# EAGLE design Arduino_Uno (EAGLE 9.6.1)
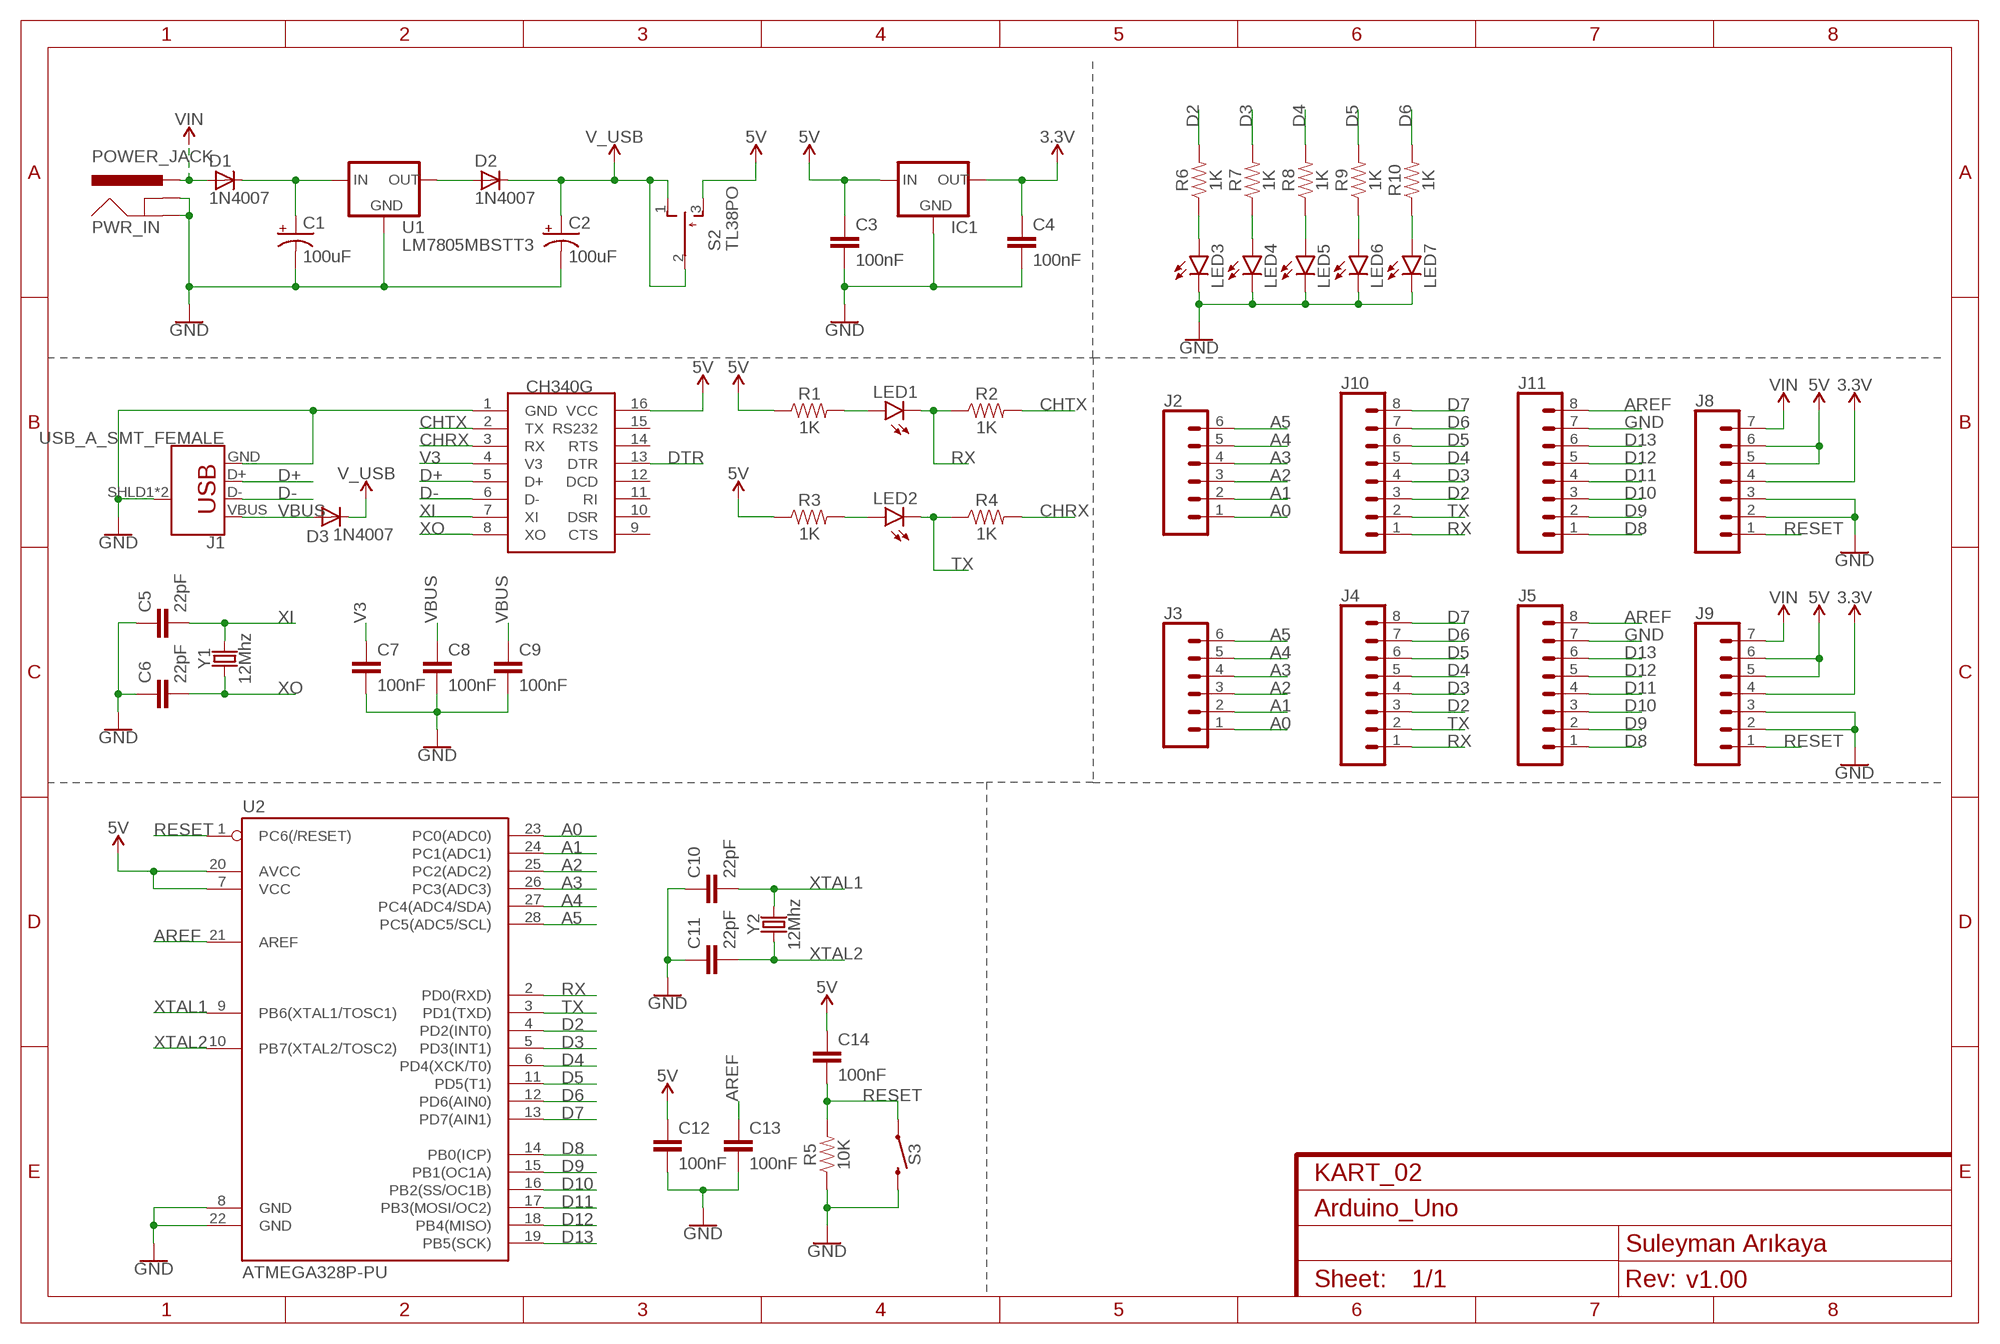
[diagram p0: schematic, sheet 1]
FRAME1 (FRAME-A4L): CNAME: KART_02; CREVISION: v1.00; DESIGNER: Suleyman Arıkaya

## Parts
C1  100uF  100UF-POLAR-25V-20%(ELEC)  [PANASONIC_D]
C2  100uF  100UF-POLAR-25V-20%(ELEC)  [PANASONIC_D]
C3  100nF  1.0UF-0805-25V-10%  [0805]
C4  100nF  1.0UF-0805-25V-10%  [0805]
C5  22pF  1.0UF-0805-25V-10%  [0805]
C6  22pF  1.0UF-0805-25V-10%  [0805]
C7  100nF  1.0UF-0805-25V-10%  [0805]
C8  100nF  1.0UF-0805-25V-10%  [0805]
C9  100nF  1.0UF-0805-25V-10%  [0805]
C10  22pF  1.0UF-0805-25V-10%  [0805]
C11  22pF  1.0UF-0805-25V-10%  [0805]
C12  100nF  1.0UF-0805-25V-10%  [0805]
C13  100nF  1.0UF-0805-25V-10%  [0805]
C14  100nF  1.0UF-0805-25V-10%  [0805]
D1  1N4007  [SMA]
D2  1N4007  [SMA]
D3  1N4007  [SMA]
IC1  LM1117  [SOT223]
J1  USB_A_SMT_FEMALE  [USB-A-S-SILK-FEMALE]
J2  CONN_06NO_SILK_FEMALE_PTH  [1X06_NO_SILK]
J3  CONN_06NO_SILK_FEMALE_PTH  [1X06_NO_SILK]
J4  CONN_08"  [1X08]
J5  CONN_08"  [1X08]
J8  CONN_07  [1X07]
J9  CONN_07  [1X07]
J10  CONN_08"  [1X08]
J11  CONN_08"  [1X08]
LED1  LEDSML0805  [SML0805]
LED2  LEDSML0805  [SML0805]
LED3  LEDSML0805  [SML0805]
LED4  LEDSML0805  [SML0805]
LED5  LEDSML0805  [SML0805]
LED6  LEDSML0805  [SML0805]
LED7  LEDSML0805  [SML0805]
PWR_IN  POWER_JACK  [POWER_JACK_PTH]
R1  1K  RESISTOR0805  [0805]
R2  1K  RESISTOR0805  [0805]
R3  1K  RESISTOR0805  [0805]
R4  1K  RESISTOR0805  [0805]
R5  10K  RESISTOR0805  [0805]
R6  1K  RESISTOR0805  [0805]
R7  1K  RESISTOR0805  [0805]
R8  1K  RESISTOR0805  [0805]
R9  1K  RESISTOR0805  [0805]
R10  1K  RESISTOR0805  [0805]
S2  TL38PO  [TL3XPO]
S3  MOMENTARY-SWITCH-SPST-PTH-6.0MM  [TACTILE_SWITCH_PTH_6.0MM]
U1  LM7805MBSTT3  L78XXD2TT  [D2PAK]
U2  ATMEGA328P-PU  ATMEGA328P_PDIP  [DIP28]
U$1  CH340G  [SOIC16]
Y1  12Mhz  CRYSTALSMD-HC49UP  [HC49UP]
Y2  12Mhz  CRYSTALSMD-HC49UP  [HC49UP]

## Nets
3.3V: C4.1 IC1.2(OUT) J8.4 J9.4
5V: C3.1 C12.1 C14.1 IC1.3(IN) J8.5 J8.6 J9.5 J9.6 R1.1 R3.1 S2.3(S) U2.7(VCC) U2.20(AVCC) U$1.16(VCC)
A0: J2.1 J3.1 U2.23(PC0(ADC0))
A1: J2.2 J3.2 U2.24(PC1(ADC1))
A2: J2.3 J3.3 U2.25(PC2(ADC2))
A3: J2.4 J3.4 U2.26(PC3(ADC3))
A4: J2.5 J3.5 U2.27(PC4(ADC4/SDA))
A5: J2.6 J3.6 U2.28(PC5(ADC5/SCL))
AREF: C13.1 J5.8 J11.8 U2.21(AREF)
CHRX: R4.2 U$1.3(RX)
CHTX: R2.2 U$1.2(TX)
D2: J4.3 J10.3 R6.2 U2.4(PD2(INT0))
D3: J4.4 J10.4 R7.2 U2.5(PD3(INT1))
D4: J4.5 J10.5 R8.2 U2.6(PD4(XCK/T0))
D5: J4.6 J10.6 R9.2 U2.11(PD5(T1))
D6: J4.7 J10.7 R10.2 U2.12(PD6(AIN0))
D7: J4.8 J10.8 U2.13(PD7(AIN1))
D8: J5.1 J11.1 U2.14(PB0(ICP))
D9: J5.2 J11.2 U2.15(PB1(OC1A))
D10: J5.3 J11.3 U2.16(PB2(SS/OC1B))
D11: J5.4 J11.4 U2.17(PB3(MOSI/OC2))
D12: J5.5 J11.5 U2.18(PB4(MISO))
D13: J5.6 J11.6 U2.19(PB5(SCK))
D+: J1.D+ U$1.5(D+)
D-: J1.D- U$1.6(D-)
DTR: U$1.13(DTR)
GND: C1.- C2.- C3.2 C4.2 C5.1 C6.1 C7.2 C8.2 C9.2 C10.1 C11.1 C12.2 C13.2 IC1.1(GND) J1.GND J1.SHLD1(SHIELD) J1.SHLD2(SHIELD) J5.7 J8.2 J8.3 J9.2 J9.3 J11.7 LED3.C LED4.C LED5.C LED6.C LED7.C PWR_IN.GND PWR_IN.GNDBREAK R5.1 S3.3 U1.2(GND) U2.8(GND) U2.22(GND) U$1.1(GND)
N$2: C1.+ D1.K(C) U1.1(IN)
N$3: D2.A U1.3(OUT)
N$4: LED2.A R3.2
N$5: LED1.A R1.2
N$6: LED3.A R6.1
N$7: LED4.A R7.1
N$8: LED5.A R8.1
N$9: LED6.A R9.1
N$10: LED7.A R10.1
RESET: C14.2 J8.1 J9.1 R5.2 S3.1 U2.1(PC6(/RESET))
RX: J4.1 J10.1 LED1.C R2.1 U2.2(PD0(RXD))
TX: J4.2 J10.2 LED2.C R4.1 U2.3(PD1(TXD))
V3: C7.1 U$1.4(V3)
V_USB: C2.+ D2.K(C) D3.K(C) S2.1(O) S2.2(P)
VBUS: C8.1 C9.1 D3.A J1.VBUS
VIN: D1.A J8.7 J9.7 PWR_IN.PWR
XI: C5.2 U$1.7(XI) Y1.2
XO: C6.2 U$1.8(XO) Y1.1
XTAL1: C10.2 U2.9(PB6(XTAL1/TOSC1)) Y2.2
XTAL2: C11.2 U2.10(PB7(XTAL2/TOSC2)) Y2.1
Unconnected: U$1.9(CTS) U$1.10(DSR) U$1.11(RI) U$1.12(DCD) U$1.14(RTS) U$1.15(RS232)

## Library data of the parts
C1 C2 = SparkFun-Capacitors:100UF-POLAR: 100µF polarized capacitors A capacitor is a passive two-terminal electrical component used to store electrical energy temporarily in an electric field.; PROD_ID: CAP-12547
C3-C14 = SparkFun-Capacitors:1.0UF: 1µF ceramic capacitors A capacitor is a passive two-terminal electrical component used to store electrical energy temporarily in an electric field.; PROD_ID: CAP-08064; VALUE: 1.0uF
D1-D3 = casovac:1N4007
IC1 = v-reg-2:LM1117
J1 = SparkFun-Connectors:USB_A: USB-A Connector Male and female variants, as well as PTH and SMT variants SparkFun Products: SparkFun XBee Explorer Dongle <https://www.sparkfun.com/products/11697> PTH Male SparkFun MicroView-USB Programmer <https://www.sparkfun.com/products/12924> SMT Male SparkFun USB Type A Female Breakout <https://www.sparkfun.com/products/12700> SMT Female; PROD_ID: CONN-09520; SF_ID: PRT-09011
J2 J3 = SparkFun-Connectors:CONN_06: Multi connection point. Often used as Generic Header-pin footprint for 0.1 inch spaced/style header connections On any of the 0.1 inch spaced packages, you can populate with these: Break Away Headers - Straight <https://www.sparkfun.com/products/116> (PRT-00116) Break Away Male Headers - Right Angle <https://www.sparkfun.com/products/553> (PRT-00553) Female Headers <https://www.sparkfun.com/products/115> (PRT-00115) Break Away Headers - Machine Pin <https://www.sparkfun.com/products/117> (PRT-00117) Break Away Female Headers - Swiss Machine Pin <https://www.sparkfun.com/products/743> (PRT-00743) Arduino Stackable Header - 6 Pin <https://www.sparkfun.com/products/9280> (PRT-09280) For SCREWTERMINALS and SPRING TERMINALS visit here: Screw Terimnals on SparkFun.com <https://www.sparkfun.com/search/results?term=Screw+Terminals> (5mm/3.5mm/2.54mm spacing) This device is also useful as a general connection point to wire up your design to another part of your project. Our various solder wires solder well into these plated through hole pads. Hook-Up Wire - Assortment (Stranded, 22 AWG) <https://www.sparkfun.com/products/11375> (PRT-11375) Hook-Up Wire - Assortment (Solid Core, 22 AWG) <https://www.sparkfun.com/products/11367> (PRT-11367) View the entire wire category on our website here <https://www.sparkfun.com/categories/141>; PROD_ID: CONN-08437
J4 J5 J10 J11 = SparkFun-Connectors:CONN_08: Multi connection point. Often used as Generic Header-pin footprint for 0.1 inch spaced/style header connections On any of the 0.1 inch spaced packages, you can populate with these: Break Away Headers - Straight <https://www.sparkfun.com/products/116> (PRT-00116) Break Away Male Headers - Right Angle <https://www.sparkfun.com/products/553> (PRT-00553) Female Headers <https://www.sparkfun.com/products/115> (PRT-00115) Break Away Headers - Machine Pin <https://www.sparkfun.com/products/117> (PRT-00117) Break Away Female Headers - Swiss Machine Pin <https://www.sparkfun.com/products/743> (PRT-00743) Arduino Stackable Header - 8 Pin <https://www.sparkfun.com/products/9279> (PRT-09279) For SCREWTERMINALS and SPRING TERMINALS visit here: Screw Terimnals on SparkFun.com <https://www.sparkfun.com/search/results?term=Screw+Terminals> (5mm/3.5mm/2.54mm spacing) This device is also useful as a general connection point to wire up your design to another part of your project. Our various solder wires solder well into these plated through hole pads. Hook-Up Wire - Assortment (Stranded, 22 AWG) <https://www.sparkfun.com/products/11375> (PRT-11375) Hook-Up Wire - Assortment (Solid Core, 22 AWG) <https://www.sparkfun.com/products/11367> (PRT-11367) View the entire wire category on our website here <https://www.sparkfun.com/categories/141> Special notes: Molex polarized connector foot print use with SKU : PRT-08231 with associated crimp pins and housings. 1MM SMD Version SKU: PRT-10208 NOTES ON THE VARIANTS LOCK and LOCK_LONGPADS... This footprint was designed to help hold the alignment of a through-hole component (i.e. 6-pin header) while soldering it into place. You may notice that each hole has been shifted either up or down by 0.005 of an inch from it's more standard position (which is a perfectly straight line). This slight alteration caused the pins (the squares in the middle) to touch the edges of the holes. Because they are alternating, it causes a "brace" to hold the component in place. 0.005 has proven to be the perfect amount of "off-center" position when using our standard breakaway headers. Although looks a little odd when you look at the bare footprint, once you have a header in there, the alteration is very hard to notice. Also,if you push a header all the way into place, it is covered up entirely on the bottom side.; PROD_ID: CONN-08438
J8 J9 = SparkFun-Connectors:CONN_07: Multi connection point. Often used as Generic Header-pin footprint for 0.1 inch spaced/style header connections On any of the 0.1 inch spaced packages, you can populate with these: Break Away Headers - Straight <https://www.sparkfun.com/products/116> (PRT-00116) Break Away Male Headers - Right Angle <https://www.sparkfun.com/products/553> (PRT-00553) Female Headers <https://www.sparkfun.com/products/115> (PRT-00115) Break Away Headers - Machine Pin <https://www.sparkfun.com/products/117> (PRT-00117) Break Away Female Headers - Swiss Machine Pin <https://www.sparkfun.com/products/743> (PRT-00743) For SCREWTERMINALS and SPRING TERMINALS visit here: Screw Terimnals on SparkFun.com <https://www.sparkfun.com/search/results?term=Screw+Terminals> (5mm/3.5mm/2.54mm spacing) This device is also useful as a general connection point to wire up your design to another part of your project. Our various solder wires solder well into these plated through hole pads. Hook-Up Wire - Assortment (Stranded, 22 AWG) <https://www.sparkfun.com/products/11375> (PRT-11375) Hook-Up Wire - Assortment (Solid Core, 22 AWG) <https://www.sparkfun.com/products/11367> (PRT-11367) View the entire wire category on our website here <https://www.sparkfun.com/categories/141> Special notes: Molex polarized connector foot print use with SKU : PRT-08231 with associated crimp pins and housings. 1MM SMD Version SKU: PRT-10208 NOTES ON THE VARIANTS LOCK and LOCK_LONGPADS... This footprint was designed to help hold the alignment of a through-hole component (i.e. 6-pin header) while soldering it into place. You may notice that each hole has been shifted either up or down by 0.005 of an inch from it's more standard position (which is a perfectly straight line). This slight alteration caused the pins (the squares in the middle) to touch the edges of the holes. Because they are alternating, it causes a "brace" to hold the component in place. 0.005 has proven to be the perfect amount of "off-center" position when using our standard breakaway headers. Although looks a little odd when you look at the bare footprint, once you have a header in there, the alteration is very hard to notice. Also,if you push a header all the way into place, it is covered up entirely on the bottom side.
LED1-LED7 = led:LED: LED OSRAM: - CHIPLED LG R971, LG N971, LY N971, LG Q971, LY Q971, LO R971, LY R971 LH N974, LH R974 LS Q976, LO Q976, LY Q976 LO Q996 - Hyper CHIPLED LW Q18S LB Q993, LB Q99A, LB R99A - SideLED LS A670, LO A670, LY A670, LG A670, LP A670 LB A673, LV A673, LT A673, LW A673 LH A674 LY A675 LS A676, LA A676, LO A676, LY A676, LW A676 LS A679, LY A679, LG A679 - Hyper Micro SIDELED® LS Y876, LA Y876, LO Y876, LY Y876 LT Y87S - SmartLED LW L88C, LW L88S LB L89C, LB L89S, LG L890 LS L89K, LO L89K, LY L89K LS L896, LA L896, LO L896, LY L896 - TOPLED LS T670, LO T670, LY T670, LG T670, LP T670 LSG T670, LSP T670, LSY T670, LOP T670, LYG T670 LG T671, LOG T671, LSG T671 LB T673, LV T673, LT T673, LW T673 LH T674 LS T676, LA T676, LO T676, LY T676, LB T676, LH T676, LSB T676, LW T676 LB T67C, LV T67C, LT T67C, LS T67K, LO T67K, LY T67K, LW E67C LS E67B, LA E67B, LO E67B, LY E67B, LB E67C, LV E67C, LT E67C LW T67C LS T679, LY T679, LG T679 LS T770, LO T770, LY T770, LG T770, LP T770 LB T773, LV T773, LT T773, LW T773 LH T774 LS E675, LA E675, LY E675, LS T675 LS T776, LA T776, LO T776, LY T776, LB T776 LHGB T686 LT T68C, LB T68C - Hyper Mini TOPLED® LB M676 - Mini TOPLED Santana® LG M470 LS M47K, LO M47K, LY M47K Source: http://www.osram.convergy.de LUXEON: - LUMILED® LXK2-PW12-R00, LXK2-PW12-S00, LXK2-PW14-U00, LXK2-PW14-V00 LXK2-PM12-R00, LXK2-PM12-S00, LXK2-PM14-U00 LXK2-PE12-Q00, LXK2-PE12-R00, LXK2-PE12-S00, LXK2-PE14-T00, LXK2-PE14-U00 LXK2-PB12-K00, LXK2-PB12-L00, LXK2-PB12-M00, LXK2-PB14-N00, LXK2-PB14-P00, LXK2-PB14-Q00 LXK2-PR12-L00, LXK2-PR12-M00, LXK2-PR14-Q00, LXK2-PR14-R00 LXK2-PD12-Q00, LXK2-PD12-R00, LXK2-PD12-S00 LXK2-PH12-R00, LXK2-PH12-S00 LXK2-PL12-P00, LXK2-PL12-Q00, LXK2-PL12-R00 Source: www.luxeon.com KINGBRIGHT: KA-3528ASYC Source: www.kingbright.com
PWR_IN = SparkFun-Connectors:POWER_JACK: Power Jack Connector This is the standard 5.5mm barrel jack for power. The PTH is the most common, proven, reliable, footprint. The Slot footprint only works if the mill layer is transmitted to the PCB fab house so be warned. Here are the connectors we sell at SparkFun: DC Barrel Power Jack/Connector <https://www.sparkfun.com/products/119> (PRT-00119) DC Barrel Power Jack/Connector (SMD) <https://www.sparkfun.com/products/12748> (PRT-12748) DC Barrel Jack Adapter - Breadboard Compatible <https://www.sparkfun.com/products/10811> (PRT-10811) It is used on this SparkFun product (and many, many others): SparkFun RedBoard - Programmed with Arduino <https://www.sparkfun.com/products/12757> (DEV-12757) Also, if you need a mating power supply or connector, please check these out: Wall Adapter Power Supply - 9VDC 650mA <https://www.sparkfun.com/products/298> (TOL-00298) DC Barrel Jack Adapter - Male <https://www.sparkfun.com/products/10287> (PRT-10287); PROD_ID: CONN-08197
R1-R10 = SparkFun-Resistors:RESISTOR: Generic Resistor Package
S2 = switch:TL38PO: TINY SWITCH ON OFF MOM Source: http://www2.produktinfo.conrad.com/datenblaetter/700000-724999/705152-da-01-de-Subminiaturschalter_TL_36YO.pdf
S3 = SparkFun-Switches:MOMENTARY-SWITCH-SPST: Momentary Switch (Pushbutton) - SPST Normally-open (NO) SPST momentary switches (buttons, pushbuttons). Variants PTH-12MM - 12mm square, through-hole Momentary Pushbutton Switch - 12mm Square <https://www.sparkfun.com/products/9190> (COM-09190) PTH-6.0MM, PTH-6.0MM-KIT - 6.0mm square, through-hole Mini Pushbutton Switch <https://www.sparkfun.com/products/97> (COM-00097) KIT package intended for soldering kit's - only one side of pads' copper is exposed. PTH-RIGHT-ANGLE-KIT - Right-angle, through-hole Right Angle Tactile Button <https://www.sparkfun.com/products/10791> - Used on SparkFun BigTime Watch Kit <https://www.sparkfun.com/products/11734> SMD-12MM - 12mm square, surface-mount Tactile Button - SMD (12mm) <https://www.sparkfun.com/products/12993> (COM-12993) Used on SparkFun PicoBoard <https://www.sparkfun.com/products/11888> SMD-4.5MM - 4.5mm Square Trackball Switch Used on SparkFun Blackberry Trackballer Breakout <https://www.sparkfun.com/products/13169> SMD-4.6MMX2.8MM - 4.60mm x 2.80mm, surface mount Used on SparkFun SAMD21 Mini Breakout <https://www.sparkfun.com/products/13664> SMD-5.2MM, SMD-5.2-REDUNDANT - 5.2mm square, surface-mount Mini Pushbutton Switch - SMD <https://www.sparkfun.com/products/8720> (COM-08720) Used on Arduino Pro Mini <https://www.sparkfun.com/products/11114> REDUNDANT package connects both switch circuits together SMD-6.0X3.5MM - 6.0 x 3.5mm, surface mount Momentary Reset Switch SMD <https://www.sparkfun.com/products/8229> (COM-08229) SMD-6.2MM-TALL - 6.2mm square, surface mount Tactile Button - SMD (6mm) <https://www.sparkfun.com/products/12992> Used on SparkFun Digital Sandbox <https://www.sparkfun.com/products/12651> SMD-RIGHT-ANGLE - Right-angle, surface mount Used on SparkFun Block for Intel® Edison - Arduino <https://www.sparkfun.com/products/13036>; PROD_ID: SWCH-08441; SF_SKU: COM-00097
U1 = v-reg-2:L78XX: VOLTAGE REGULATOR
U2 = SparkFun-IC-Microcontroller:ATMEGA328P_PDIP: Atmel 328P Through hole ATMEGA328P uC used in the Arduino 32kb flash, 1k EEPROM, 2k SRAM Datasheet <http://www.sparkfun.com/datasheets/Components/SMD/ATMega328.pdf> SparkFun Products Storefront component: AVR 28 Pin 20MHz 32K 6A/D - ATMega328P <https://www.sparkfun.com/products/9061> (COM-09061) SparkFun Simon Says - Through-Hole Soldering Kit <https://www.sparkfun.com/products/10547> (KIT-10547) SparkFun Learn to Solder - Simon Says <https://www.sparkfun.com/products/13708> (KIT-13708) SparkFun BigTime Watch Kit <https://www.sparkfun.com/products/11734> (KIT-11734) SparkFun ClockIt <https://www.sparkfun.com/products/10930> (KIT-10930) SparkFun Serial Enabled LCD Kit <https://www.sparkfun.com/products/10097> (LCD-10097) SparkFun Simon Tilts - Through Hole Soldering Kit <https://www.sparkfun.com/products/12634> (KIT-12634) SparkFun Frequency Counter Kit <https://www.sparkfun.com/products/10140> (KIT-10140) FabFM Radio Kit <https://www.sparkfun.com/products/11043> (KIT-11043) SparkFun Binary Blaster Kit <https://www.sparkfun.com/products/12037> (KIT-12037) SparkFun Metro-Gnome <https://www.sparkfun.com/products/9236> (KIT-09236) ATmega328 with Arduino Optiboot (Uno) <https://www.sparkfun.com/products/10524> (DEV-10524); PROD_ID: IC-09136; VALUE: 328P
U$1 = ch340g:CH340G
Y1 Y2 = SparkFun-Clocks:CRYSTAL: Crystals (Generic) These are passive quartz crystals, which can be used as a clock source for a microcontroller. Crystal's are two-terminal devices. They require external "load" capacitors to generate an oscillating signal.

## Board
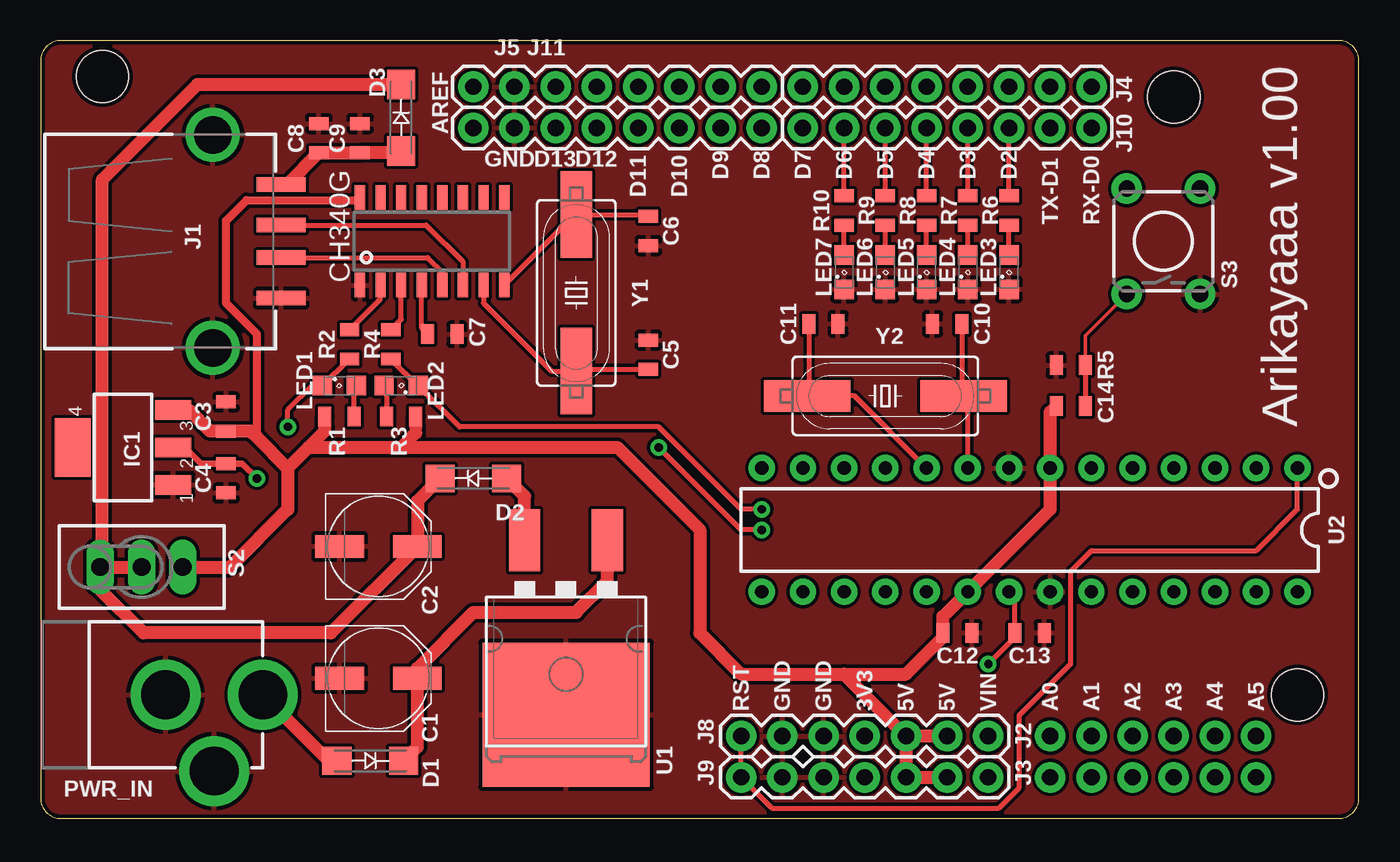
[diagram p1: board, top side]
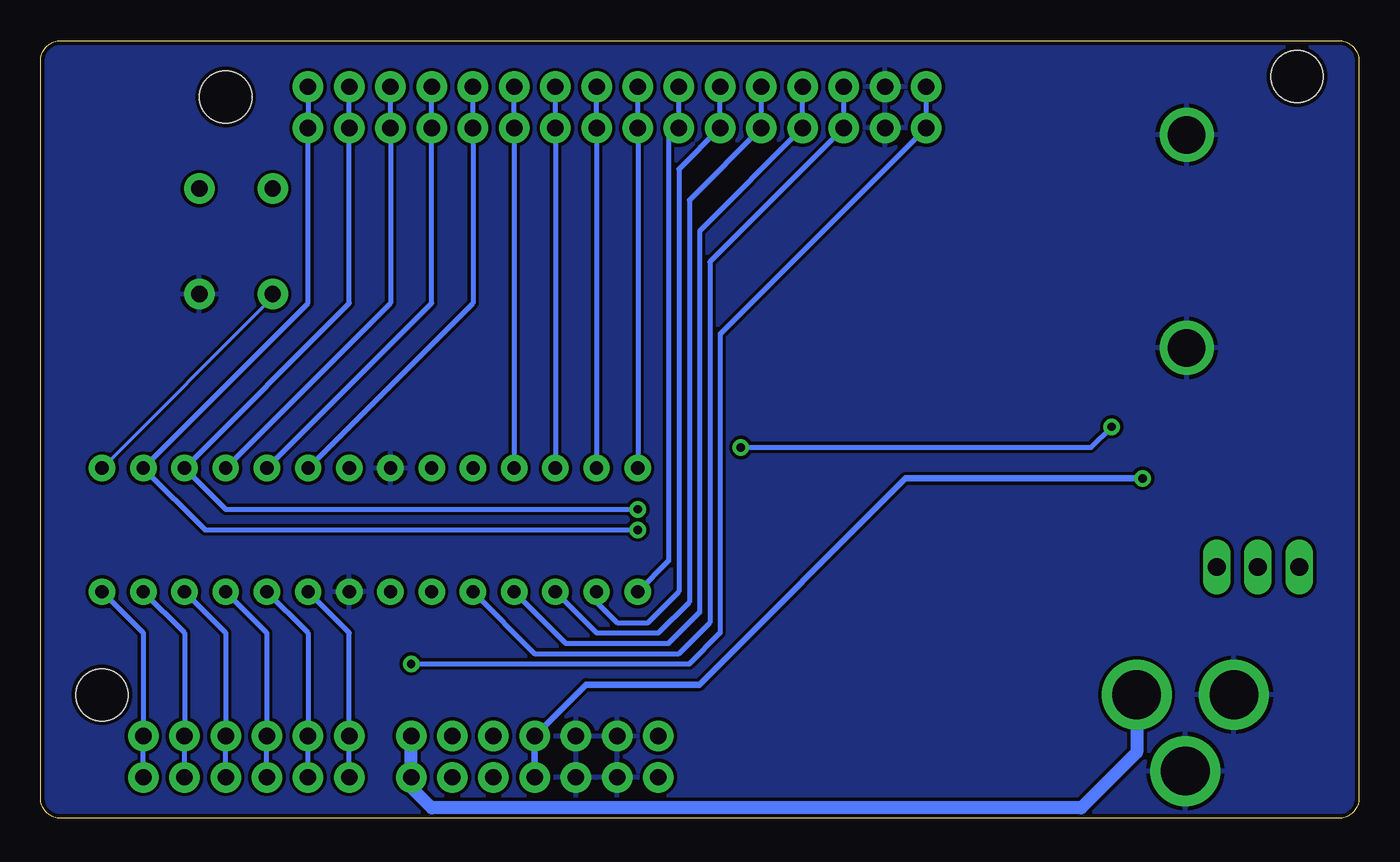
[diagram p2: board, bottom side, seen from below]

Size 81.26 x 47.93 mm. Coordinates in mm from the lower left corner, seen from the top.
Outline: 0,46.66 0,1.27 arc90 1.27,0 79.99,0 arc90 81.26,1.27 81.26,46.66 arc90 79.99,47.93 1.27,47.93 arc90 0,46.66
Copper layers (1*16): Top 0.035mm / dielectric 1.5mm / Bottom 0.035mm
Design rules "SparkFun": minimum track width 8mil, minimum drill 20mil, track to track 8mil, track to pad 8mil, pad to pad 8mil, via to via 8mil, smd to smd 8mil, copper to edge 10mil, drill to drill 8mil, minimum pad ring 12mil, minimum via ring 10mil, stop-mask expansion 4mil, vias tented up to drill 25mil, thermal gap 10mil
Holes 3.2 mm at 3.81,45.72 69.85,44.45 77.47,7.62

### Footprints (pad centres in the part's own frame; a part is rotated, then mirrored left to right if it is on the bottom)
PANASONIC_D = smd 3 x 1.4: + 2.4,0; - -2.4,0
0805 = smd 0.8 x 1.2: 1 -0.9,0; 2 0.9,0
SMA = smd 1.8 x 1.7: A -2.05,0; K 2.05,0
SOT223 = smd 1.219 x 2.235: 1 -2.311,-3.099; 2 0,-3.099; 3 2.311,-3.099 | smd 3.6 x 2.2: 4 0,3.099
USB-A-S-SILK-FEMALE = smd 3 x 0.9: D+ 7.212,-1; D- 7.212,1; GND 7.212,-3.5; VBUS 7.212,3.5 | drill 2.311: SHLD1 3,-6.566; SHLD2 3,6.566
1X06_NO_SILK = drill 1.016 pad 1.88: 1 0,0; 2 2.54,0; 3 5.08,0; 4 7.62,0; 5 10.16,0; 6 12.7,0
1X08 = drill 1.016 pad 1.88: 1 0,0; 2 2.54,0; 3 5.08,0; 4 7.62,0; 5 10.16,0; 6 12.7,0; 7 15.24,0; 8 17.78,0
1X07 = drill 1.016 pad 1.88: 1 0,0; 2 2.54,0; 3 5.08,0; 4 7.62,0; 5 10.16,0; 6 12.7,0; 7 15.24,0
SML0805 = smd 1.2 x 1.2: A 1.05,0; C -1.05,0
POWER_JACK_PTH = drill 2.997 pad 4.318: GND 0,7.7; GNDBREAK 4.7,10.7; PWR 0,13.7
TL3XPO = drill 1.1 pad 1.422 long: 1 -2.54,0; 2 0,0; 3 2.54,0
TACTILE_SWITCH_PTH_6.0MM = drill 1.016 pad 1.88: 1 -3.251,2.261; 2 3.251,2.261; 3 -3.251,-2.261; 4 3.251,-2.261
D2PAK = smd 1.93 x 3.81: 1 -2.55,-8.25; 3 2.55,-8.25 | smd 10.3 x 8.9: 2 0,2.5
DIP28 = drill 0.813 pad 1.626: 1 -16.51,-3.81; 2 -13.97,-3.81; 3 -11.43,-3.81; 4 -8.89,-3.81; 5 -6.35,-3.81; 6 -3.81,-3.81; 7 -1.27,-3.81; 8 1.27,-3.81; 9 3.81,-3.81; 10 6.35,-3.81; 11 8.89,-3.81; 12 11.43,-3.81; 13 13.97,-3.81; 14 16.51,-3.81; 15 16.51,3.81; 16 13.97,3.81; 17 11.43,3.81; 18 8.89,3.81; 19 6.35,3.81; 20 3.81,3.81; 21 1.27,3.81; 22 -1.27,3.81; 23 -3.81,3.81; 24 -6.35,3.81; 25 -8.89,3.81; 26 -11.43,3.81; 27 -13.97,3.81; 28 -16.51,3.81
SOIC16 = smd 0.635 x 1.524: 1 -4.445,-2.695; 2 -3.175,-2.695; 3 -1.905,-2.695; 4 -0.635,-2.695; 5 0.635,-2.695; 6 1.905,-2.695; 7 3.175,-2.695; 8 4.445,-2.695; 9 4.445,2.695; 10 3.175,2.695; 11 1.905,2.695; 12 0.635,2.695; 13 -0.635,2.695; 14 -1.905,2.695; 15 -3.175,2.695; 16 -4.445,2.695
HC49UP = smd 5.334 x 1.93: 1 -4.826,0; 2 4.826,0

### Placement (x,y rotation side)
C1  20.83,8.64 0 top
C2  20.83,16.76 0 top
C3  11.43,24.77 90 top
C4  11.43,20.95 270 top
C5  37.47,28.57 270 top
C6  37.47,36.2 90 top
C7  24.77,29.84 0 top
C8  17.14,41.91 90 top
C9  19.68,41.91 90 top
C10  55.88,30.48 0 top
C11  48.26,30.48 180 top
C12  56.52,11.43 0 top
C13  60.96,11.43 0 top
C14  63.5,25.4 0 top
D1  20.32,3.56 0 top
D2  26.67,20.95 180 top
D3  22.23,43.18 90 top
IC1  5.08,22.86 90 top
J1  7.62,35.56 0 top
J2  62.23,5.08 0 top
J3  62.23,2.54 0 top
J4  64.77,45.09 180 top
J5  44.45,45.09 180 top
J8  43.18,5.08 0 top
J9  43.18,2.54 0 top
J10  64.77,42.55 180 top
J11  44.45,42.55 180 top
LED1  18.41,26.67 0 top
LED2  22.23,26.67 180 top
LED3  59.69,33.66 90 top
LED4  57.15,33.66 90 top
LED5  54.61,33.66 90 top
LED6  52.07,33.66 90 top
LED7  49.53,33.66 90 top
PWR_IN  0,7.62 270 top
R1  18.41,24.77 0 top
R2  19.05,29.21 90 top
R3  22.23,24.77 180 top
R4  21.59,29.21 90 top
R5  63.5,27.94 0 top
R6  59.69,37.47 90 top
R7  57.15,37.47 90 top
R8  54.61,37.47 90 top
R9  52.07,37.47 90 top
R10  49.53,37.47 90 top
S2  6.22,15.49 0 top
S3  69.22,35.56 90 top
U1  32.38,8.89 180 top
U2  60.96,17.78 180 top
U$1  24.13,35.56 0 top
Y1  33.02,32.38 270 top
Y2  52.07,26.04 0 top

### Tracks (layer width: path | path; a pad name or v marks a point on that pad's centre or on a via)
3.3V  (via drill 0.51)
  Top 0.406: v13.34,20.95 12.44,21.86 C4.1 9.89,21.86 8.89,22.86 IC1.2
  Bottom 0.406: J9.4 J8.4 47.62,8.26 40.64,8.26 27.94,20.95 v13.34,20.95
5V
  Top 0.508: 13.34,23.5 13.34,29.84 11.43,31.75 11.43,36.83 12.7,38.1 19.53,38.1 U$1.16
  Top 0.61: 17.52,23.86 17.52,24.13 | 23.12,23.76 23.12,24.13
  Top 0.813: S2.3 11.68,15.49 15.24,19.05 15.24,21.59 | 15.24,21.59 13.34,23.5 12.96,23.86 C3.1 10.43,23.86 9.12,25.17 IC1.3 | 15.24,21.59 16.51,22.86 | 16.51,22.86 17.52,23.86 | 17.52,24.13 R1.1 | 16.51,22.86 22.23,22.86 | 22.23,22.86 23.12,23.76 | 23.12,24.13 R3.1 | 22.23,22.86 35.56,22.86 40.64,17.78 40.64,11.43 43.18,8.89 49.53,8.89 | J8.5 49.53,8.89 | 49.53,8.89 53.34,8.89 55.62,11.16 C12.1 55.62,12.44 U2.20 62.23,19.05 U2.7 62.23,25.03 C14.1 | J8.5 J9.5 J9.6 | J8.6 J8.5
A0
  Bottom 0.305: J3.1 J2.1 62.23,11.43 U2.23
A1
  Bottom 0.305: J3.2 J2.2 64.77,11.43 U2.24
A2
  Bottom 0.305: J3.3 J2.3 67.31,11.43 U2.25
A3
  Bottom 0.305: J3.4 J2.4 69.85,11.43 U2.26
A4
  Bottom 0.305: J3.5 J2.5 72.39,11.43 U2.27
A5
  Bottom 0.305: U2.28 74.93,11.43 J2.6 J3.6
AREF  (via drill 0.51)
  Top 0.305: U2.21 60.06,13.6 C13.1 60.06,11.16 v58.42,9.53
  Bottom 0.305: J5.8 J11.8 39.37,29.84 39.37,11.43 41.27,9.53 v58.42,9.53
CHRX
  Top 0.305: R4.2 22.23,30.75 U$1.3
CHTX
  Top 0.305: R2.2 20.95,32.02 U$1.2
D2
  Top 0.305: R6.2 J10.3
  Bottom 0.305: U2.4 59.69,31.75 J10.3 J4.3
D3
  Top 0.305: R7.2 J10.4
  Bottom 0.305: J4.4 J10.4 57.15,31.75 U2.5
D4
  Top 0.305: R8.2 J10.5
  Bottom 0.305: U2.6 54.61,31.75 J10.5 J4.5
D5
  Top 0.305: R9.2 J10.6
  Bottom 0.305: J4.6 J10.6 U2.11
D6
  Top 0.305: R10.2 J10.7
  Bottom 0.305: J4.7 J10.7 U2.12
D7
  Bottom 0.305: J4.8 J10.8 U2.13
D8
  Bottom 0.305: J5.1 J11.1 U2.14
D9
  Bottom 0.305: J5.2 J11.2 42.55,41.91 42.55,15.88 U2.15
D10
  Bottom 0.305: J5.3 J11.3 41.91,40.01 41.91,13.97 43.81,12.06 45.72,12.06 46.99,13.34 U2.16
D11
  Bottom 0.305: J5.4 J11.4 41.27,38.1 41.27,13.34 43.18,11.43 46.99,11.43 U2.17
D12
  Bottom 0.305: J5.5 J11.5 40.64,36.2 40.64,12.7 42.55,10.79 48.9,10.79 U2.18
D13
  Bottom 0.305: J5.6 J11.6 40.01,34.29 40.01,12.06 41.91,10.16 50.8,10.16 U2.19
D+
  Top 0.305: J1.D+ 23.86,34.56 24.77,33.66 U$1.5
D-
  Top 0.305: J1.D- 23.77,36.56 26.04,34.29 U$1.6
GND
  pour Top: -2.54,52.07 -2.54,-2.54 83.82,-2.54 83.82,52.07
  pour Bottom: -5.08,54.61 -5.08,-3.81 -5.08,-5.08 86.36,-5.08 86.36,54.61
N$2
  Top 0.813: D1.K 23.23,4.41 C1.+ 23.23,9.26 26.67,12.7 33.02,12.7 34.94,14.62 U1.1
N$3
  Top 0.813: U1.3 29.84,19.84 D2.A
N$4
  Top 0.305: LED2.A 21.32,26.52 R3.2
N$5
  Top 0.305: R1.2 19.32,26.52 LED1.A
N$6
  Top 0.305: LED3.A R6.1
N$7
  Top 0.305: LED4.A R7.1
N$8
  Top 0.305: LED5.A R8.1
N$9
  Top 0.305: LED6.A R9.1
N$10
  Top 0.305: LED7.A R10.1
RESET
  Top 0.203: R5.2 64.4,29.75 S3.1
  Top 0.305: J8.1 J9.1 45.09,0.64 59.05,0.64 60.33,1.91 60.33,6.35 63.5,9.53 63.5,15.24 64.77,16.51 74.93,16.51 77.47,19.05 U2.1 | R5.2 C14.2
  Bottom 0.203: U2.1 66.95,32.11 S3.1
RX  (via drill 0.51)
  Top 0.305: R2.1 19,28.31 LED1.C 16.73,26.67 15.24,25.18 v15.24,24.13 | v44.45,17.78 43.18,17.78 v38.1,22.86
  Bottom 0.305: J4.1 J10.1 64.77,31.75 U2.2 71.12,17.78 v44.45,17.78 | v15.24,24.13 16.51,22.86 v38.1,22.86
TX  (via drill 0.51)
  Top 0.305: R4.1 23.23,26.67 LED2.C 25.82,24.13 38.1,24.13 43.18,19.05 v44.45,19.05
  Bottom 0.305: J4.2 J10.2 62.23,31.75 U2.3 69.85,19.05 v44.45,19.05
V3
  Top 0.305: C7.1 23.5,30.21 U$1.4
V_USB
  Top 0.813: D2.K 23.23,19.56 C2.+ 17.89,11.43 6.35,11.43 3.68,14.1 S2.1 | D3.K 9.67,45.23 3.81,39.37 3.81,15.62 S2.1 | S2.1 S2.2
VBUS
  Top 0.813: D3.A 22.11,41.01 C9.1 C8.1 15.2,39.06 J1.VBUS
VIN
  Top 0.813: PWR_IN.PWR 17.76,3.56 D1.A
  Bottom 0.813: PWR_IN.PWR 13.7,4.08 17.12,0.66 57.15,0.66 58.42,1.93 J9.7 J8.7
XI
  Top 0.305: U$1.7 27.3,31.75 31.5,27.56 Y1.2 33.14,27.68 C5.2
XO
  Top 0.305: U$1.8 32.92,37.21 Y1.1 37.35,37.21 C6.2
XTAL1
  Top 0.305: U2.9 57.15,25.78 Y2.2 56.78,26.15 C10.2
XTAL2
  Top 0.305: U2.10 50.16,26.04 Y2.1 47.36,26.15 C11.2

### Text on the board
tPlace: AREF | GND | D13 | D12 | D11 | D10 | D9 | D8 | D7 | D6 | D5 | D4 | D3 | D2 | TX-D1 | RX-D0 | Arikayaaa v1.00 | RST | GND | GND | 3V3 | 5V | 5V | VIN | A0 | A1 | A2 | A3 | A4 | A5